# Altium schematic sheet 06_FPGA POWER.SchDoc
size 420 x 297 mm
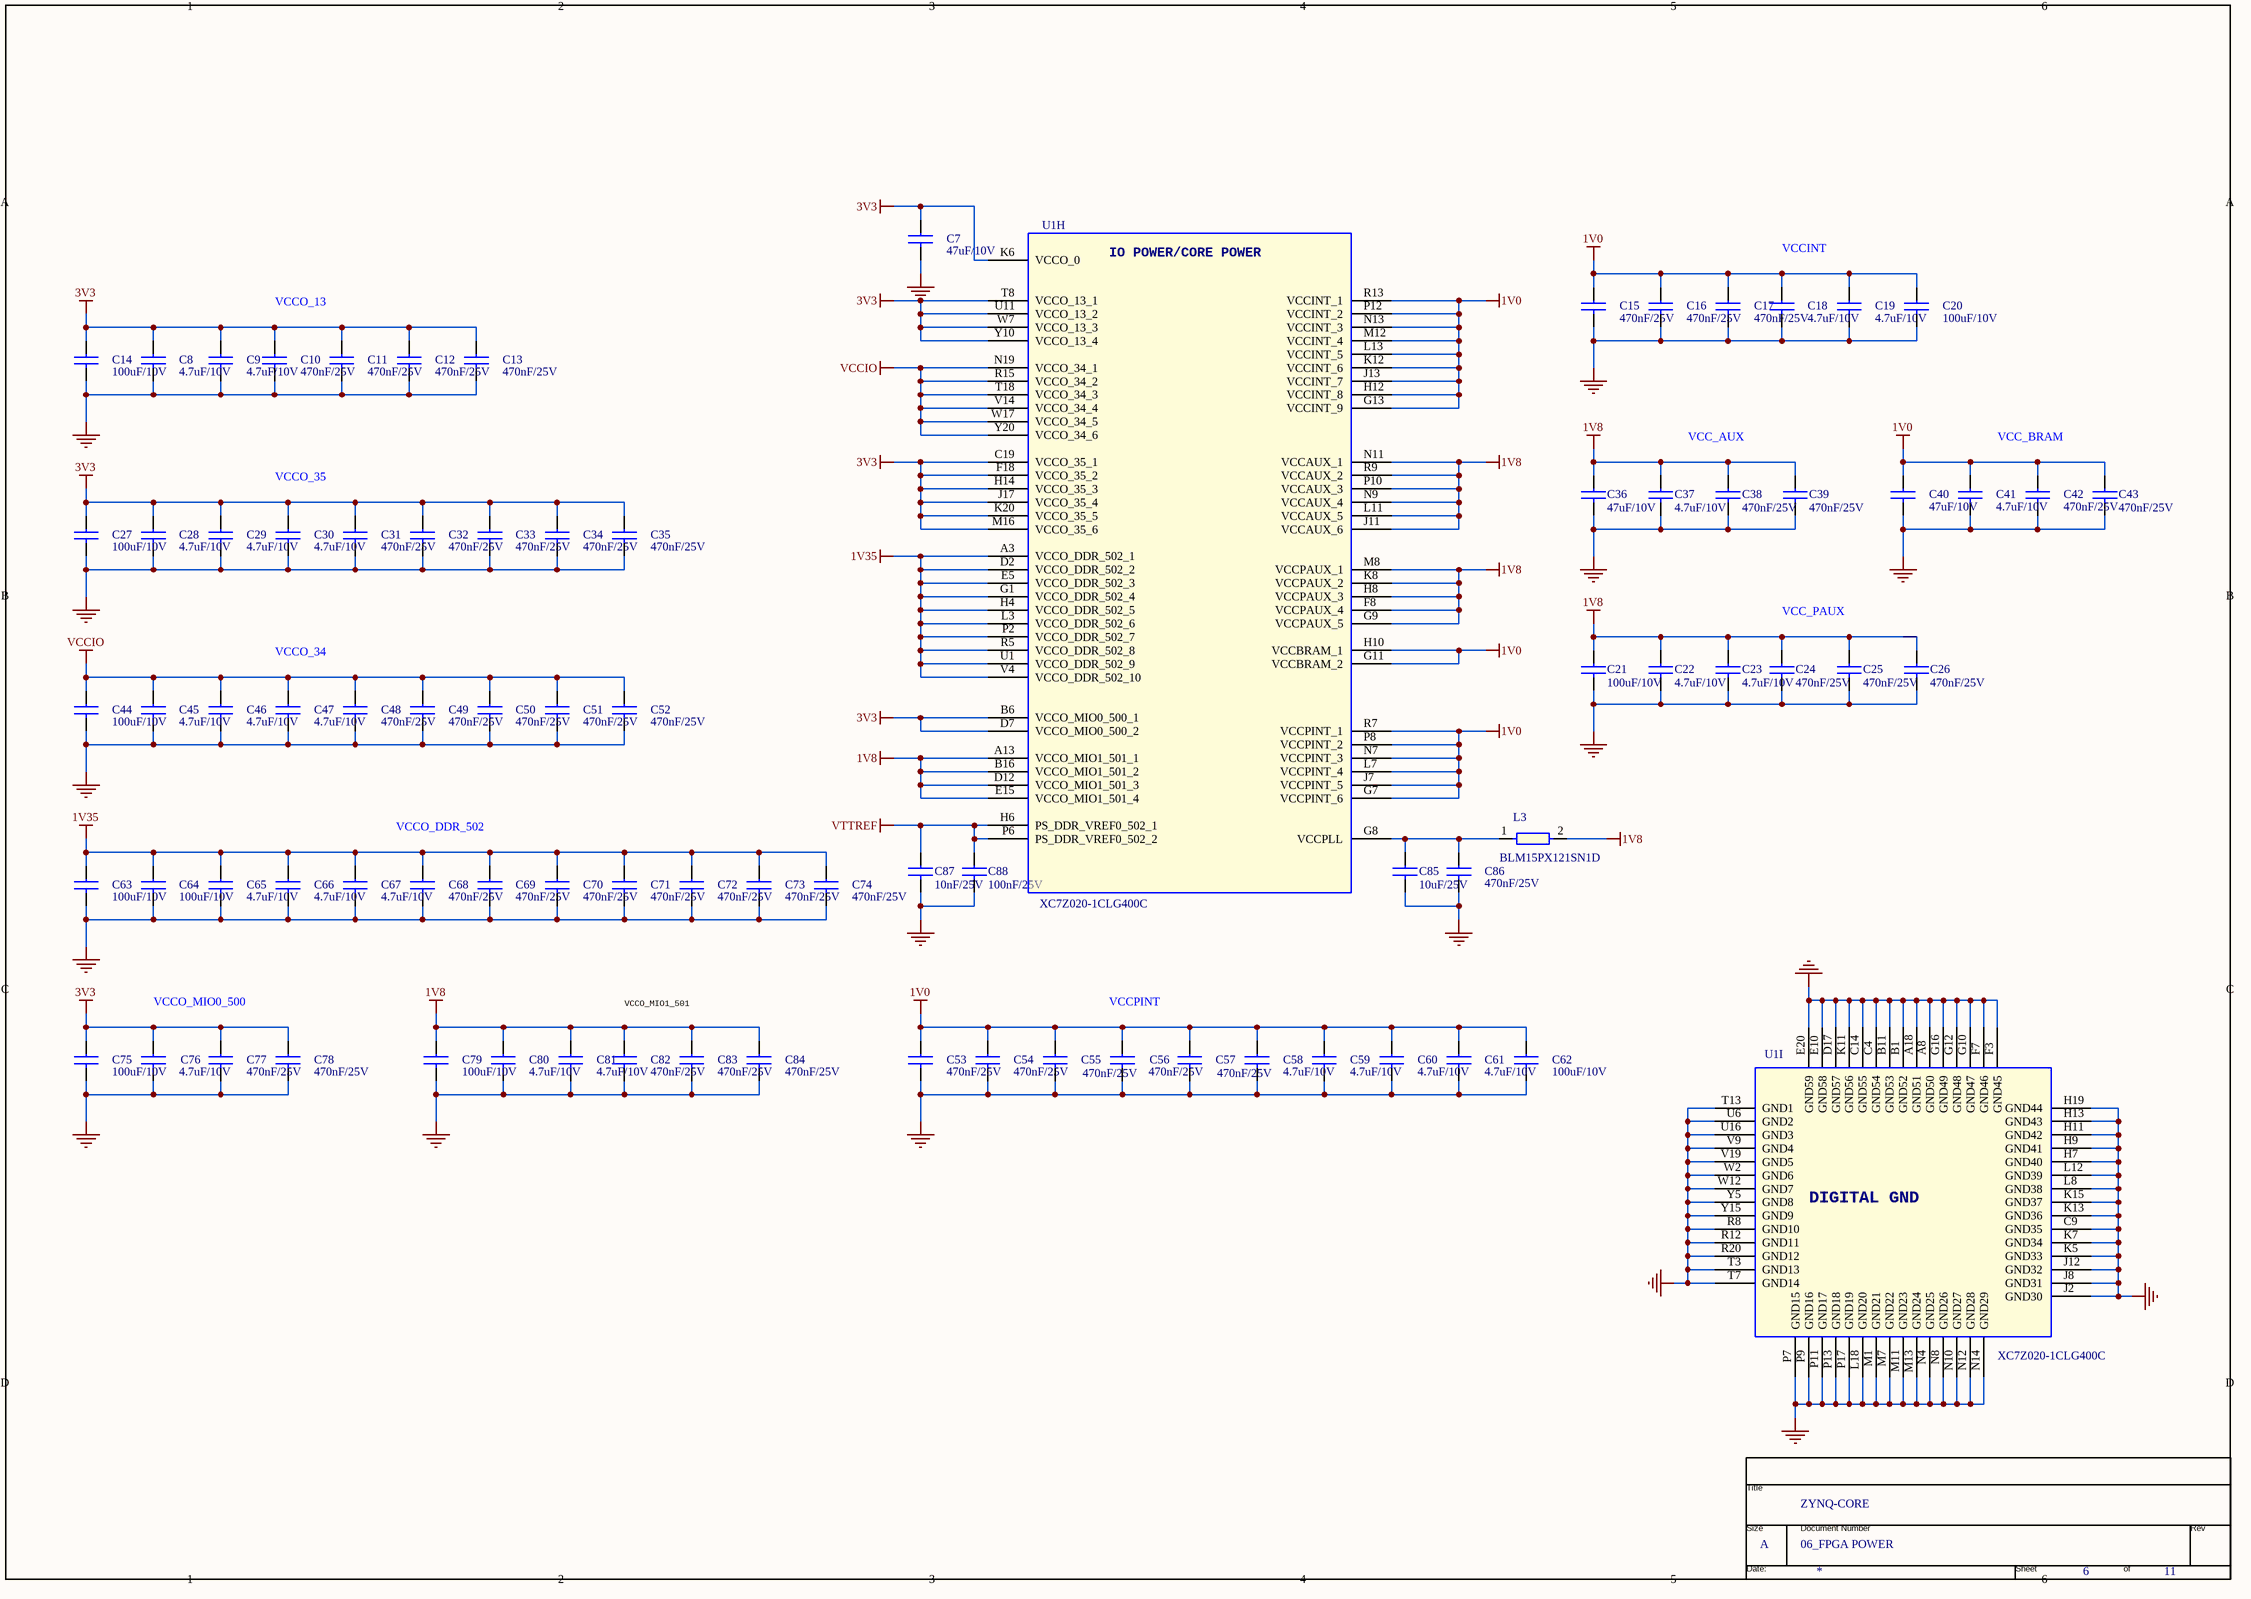
[diagram p0: 06_FPGA POWER.SchDoc]

## Parts
*  Page Count: 11  Page Number: 6  Page Size: A  Title: ZYNQ-CORE  Doc: 06_FPGA POWER  (hidden comment: TitleBlock0)  (graphical)
C7  47uF/10V  [C0805]
C8  4.7uF/10V  [C0402]
C9  4.7uF/10V  [C0402]
C10  470nF/25V  [C0402]
C11  470nF/25V  [C0402]
C12  470nF/25V  [C0402]
C13  470nF/25V  [C0402]
C14  100uF/10V  [1206C-N]
C15  470nF/25V  [C0402]
C16  470nF/25V  [C0402]
C17  470nF/25V  [C0402]
C18  4.7uF/10V  [C0402]
C19  4.7uF/10V  [C0402]
C20  100uF/10V  [1206C-N]
C21  100uF/10V  [1206C-N]
C22  4.7uF/10V  [C0402]
C23  4.7uF/10V  [C0402]
C24  470nF/25V  [C0402]
C25  470nF/25V  [C0402]
C26  470nF/25V  [C0402]
C27  100uF/10V  [1206C-N]
C28  4.7uF/10V  [C0402]
C29  4.7uF/10V  [C0402]
C30  4.7uF/10V  [C0402]
C31  470nF/25V  [C0402]
C32  470nF/25V  [C0402]
C33  470nF/25V  [C0402]
C34  470nF/25V  [C0402]
C35  470nF/25V  [C0402]
C36  47uF/10V  [C0805]
C37  4.7uF/10V  [C0402]
C38  470nF/25V  [C0402]
C39  470nF/25V  [C0402]
C40  47uF/10V  [C0805]
C41  4.7uF/10V  [C0402]
C42  470nF/25V  [C0402]
C43  470nF/25V  [C0402]
C44  100uF/10V  [1206C-N]
C45  4.7uF/10V  [C0402]
C46  4.7uF/10V  [C0402]
C47  4.7uF/10V  [C0402]
C48  470nF/25V  [C0402]
C49  470nF/25V  [C0402]
C50  470nF/25V  [C0402]
C51  470nF/25V  [C0402]
C52  470nF/25V  [C0402]
C53  470nF/25V  [C0402]
C54  470nF/25V  [C0402]
C55  470nF/25V  [C0402]
C56  470nF/25V  [C0402]
C57  470nF/25V  [C0402]
C58  4.7uF/10V  [C0402]
C59  4.7uF/10V  [C0402]
C60  4.7uF/10V  [C0402]
C61  4.7uF/10V  [C0402]
C62  100uF/10V  [1206C-N]
C63  100uF/10V  [1206C-N]
C64  100uF/10V  [1206C-N]
C65  4.7uF/10V  [C0402]
C66  4.7uF/10V  [C0402]
C67  4.7uF/10V  [C0402]
C68  470nF/25V  [C0402]
C69  470nF/25V  [C0402]
C70  470nF/25V  [C0402]
C71  470nF/25V  [C0402]
C72  470nF/25V  [C0402]
C73  470nF/25V  [C0402]
C74  470nF/25V  [C0402]
C75  100uF/10V  [1206C-N]
C76  4.7uF/10V  [C0402]
C77  470nF/25V  [C0402]
C78  470nF/25V  [C0402]
C79  100uF/10V  [1206C-N]
C80  4.7uF/10V  [C0402]
C81  4.7uF/10V  [C0402]
C82  470nF/25V  [C0402]
C83  470nF/25V  [C0402]
C84  470nF/25V  [C0402]
C85  10uF/25V  [C0603]
C86  470nF/25V  [C0402]
C87  10nF/25V  [C0402]
C88  100nF/25V  [C0402]
L3  BLM15PX121SN1D  [L0402]
U1  XC7Z020-1CLG400C  [CLG400]  (parts H,I of 9)

## Nets
1V0: C15.1 C16.1 C17.1 C18.1 C19.1 C20.1 C40.1 C41.1 C42.1 C43.1 C53.1 C54.1 C55.1 C56.1 C57.1 C58.1 C59.1 C60.1 C61.1 C62.1 U1.G7(VCCPINT_6) U1.G11(VCCBRAM_2) U1.G13(VCCINT_9) U1.H10(VCCBRAM_1) U1.H12(VCCINT_8) U1.J7(VCCPINT_5) U1.J13(VCCINT_7) U1.K12(VCCINT_6) U1.L7(VCCPINT_4) U1.L13(VCCINT_5) U1.M12(VCCINT_4) U1.N7(VCCPINT_3) U1.N13(VCCINT_3) U1.P8(VCCPINT_2) U1.P12(VCCINT_2) U1.R7(VCCPINT_1) U1.R13(VCCINT_1)
1V8: C21.1 C22.1 C23.1 C24.1 C25.1 C26.1 C36.1 C37.1 C38.1 C39.1 C79.1 C80.1 C81.1 C82.1 C83.1 C84.1 L3.2 U1.A13(VCCO_MIO1_501_1) U1.B16(VCCO_MIO1_501_2) U1.D12(VCCO_MIO1_501_3) U1.E15(VCCO_MIO1_501_4) U1.F8(VCCPAUX_4) U1.G9(VCCPAUX_5) U1.H8(VCCPAUX_3) U1.J11(VCCAUX_6) U1.K8(VCCPAUX_2) U1.L11(VCCAUX_5) U1.M8(VCCPAUX_1) U1.N9(VCCAUX_4) U1.N11(VCCAUX_1) U1.P10(VCCAUX_3) U1.R9(VCCAUX_2)
1V35: C63.1 C64.1 C65.1 C66.1 C67.1 C68.1 C69.1 C70.1 C71.1 C72.1 C73.1 C74.1 U1.A3(VCCO_DDR_502_1) U1.D2(VCCO_DDR_502_2) U1.E5(VCCO_DDR_502_3) U1.G1(VCCO_DDR_502_4) U1.H4(VCCO_DDR_502_5) U1.L3(VCCO_DDR_502_6) U1.P2(VCCO_DDR_502_7) U1.R5(VCCO_DDR_502_8) U1.U1(VCCO_DDR_502_9) U1.V4(VCCO_DDR_502_10)
3V3: C7.1 C8.1 C9.1 C10.1 C11.1 C12.1 C13.1 C14.1 C27.1 C28.1 C29.1 C30.1 C31.1 C32.1 C33.1 C34.1 C35.1 C75.1 C76.1 C77.1 C78.1 U1.B6(VCCO_MIO0_500_1) U1.C19(VCCO_35_1) U1.D7(VCCO_MIO0_500_2) U1.F18(VCCO_35_2) U1.H14(VCCO_35_3) U1.J17(VCCO_35_4) U1.K6(VCCO_0) U1.K20(VCCO_35_5) U1.M16(VCCO_35_6) U1.T8(VCCO_13_1) U1.U11(VCCO_13_2) U1.W7(VCCO_13_3) U1.Y10(VCCO_13_4)
GND: C7.2 C8.2 C9.2 C10.2 C11.2 C12.2 C13.2 C14.2 C15.2 C16.2 C17.2 C18.2 C19.2 C20.2 C21.2 C22.2 C23.2 C24.2 C25.2 C26.2 C27.2 C28.2 C29.2 C30.2 C31.2 C32.2 C33.2 C34.2 C35.2 C36.2 C37.2 C38.2 C39.2 C40.2 C41.2 C42.2 C43.2 C44.2 C45.2 C46.2 C47.2 C48.2 C49.2 C50.2 C51.2 C52.2 C53.2 C54.2 C55.2 C56.2 C57.2 C58.2 C59.2 C60.2 C61.2 C62.2 C63.2 C64.2 C65.2 C66.2 C67.2 C68.2 C69.2 C70.2 C71.2 C72.2 C73.2 C74.2 C75.2 C76.2 C77.2 C78.2 C79.2 C80.2 C81.2 C82.2 C83.2 C84.2 C85.2 C86.2 C87.2 C88.2 U1.A8(GND50) U1.A18(GND51) U1.B1(GND52) U1.B11(GND53) U1.C4(GND54) U1.C9(GND35) U1.C14(GND55) U1.D17(GND57) U1.E10(GND58) U1.E20(GND59) U1.F3(GND45) U1.F7(GND46) U1.G10(GND47) U1.G12(GND48) U1.G16(GND49) U1.H7(GND40) U1.H9(GND41) U1.H11(GND42) U1.H13(GND43) U1.H19(GND44) U1.J2(GND30) U1.J8(GND31) U1.J12(GND32) U1.K5(GND33) U1.K7(GND34) U1.K11(GND56) U1.K13(GND36) U1.K15(GND37) U1.L8(GND38) U1.L12(GND39) U1.L18(GND20) U1.M1(GND21) U1.M7(GND22) U1.M11(GND23) U1.M13(GND24) U1.N4(GND25) U1.N8(GND26) U1.N10(GND27) U1.N12(GND28) U1.N14(GND29) U1.P7(GND15) U1.P9(GND16) U1.P11(GND17) U1.P13(GND18) U1.P17(GND19) U1.R8(GND10) U1.R12(GND11) U1.R20(GND12) U1.T3(GND13) U1.T7(GND14) U1.T13(GND1) U1.U6(GND2) U1.U16(GND3) U1.V9(GND4) U1.V19(GND5) U1.W2(GND6) U1.W12(GND7) U1.Y5(GND8) U1.Y15(GND9)
VCCIO: C44.1 C45.1 C46.1 C47.1 C48.1 C49.1 C50.1 C51.1 C52.1 U1.N19(VCCO_34_1) U1.R15(VCCO_34_2) U1.T18(VCCO_34_3) U1.V14(VCCO_34_4) U1.W17(VCCO_34_5) U1.Y20(VCCO_34_6)
VTTREF: C87.1 C88.1 U1.H6(PS_DDR_VREF0_502_1) U1.P6(PS_DDR_VREF0_502_2)
NetC85_1: C85.1 C86.1 L3.1 U1.G8(VCCPLL)

## Notes on the sheet
- VCCINT
- VCCO_13
- VCC_AUX
- VCC_BRAM
- VCCO_35
- VCCO_34
- VCC_PAUX
- VCCO_DDR_502
- VCCO_MIO0_500
- VCCO_MIO1_501
- VCCPINT
- (in symbol TitleBlock0) Title; Size; Document Number; Rev; Date:; Sheet; of
- (in symbol Zynq7010/7020, part H) IO POWER/CORE POWER
- (in symbol Zynq7010/7020, part I) DIGITAL GND

## Library data of the parts
C7-C88 = CAP NP_Dup1
  C7 C36 C40: PCB Footprint: C0805
  C8-C13 C15-C19 C22-C26 C28-C35 C37-C39 C41-C43 C45-C61 C65-C74 C76-C78 C80-C84 C86-C88: PCB Footprint: C0402
  C14 C20 C21 C27 C44 C62-C64 C75 C79: PCB Footprint: 1206C-N
  C85: PCB Footprint: C0603
L3 = FB: 1 Description: Ferrite Bead SMD high impedance 200mA, 0.7 Ohms, 600R@100MHz; 2 Source: Murata; 4 Supply Information: MIRA 7636/17; 7 Date: 2001-04-02; PCB Footprint: L0402
U1 = Zynq7010/7020: PCB Footprint: CLG400
* = TitleBlock0: Page Create Date: March  8, 1995; Page Modify Date: *